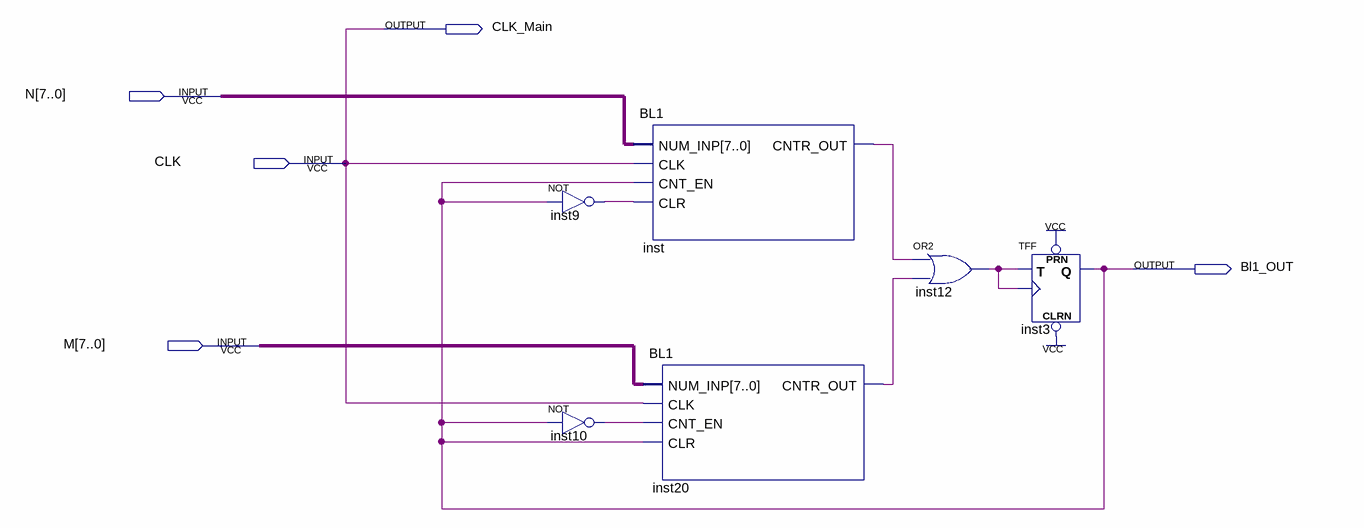
[diagram p0: schematic sheet]
// Quartus schematic BLOCK_1.bdf as structural Verilog: 6 symbols, 5 pins
module BLOCK_1 (
  input  [7:0] N,
  input  CLK,
  input  [7:0] M,
  output CLK_Main,
  output Bl1_OUT
);

  wire inst9_out, inst10_out, inst12_out, inst20_cntr_out, inst_cntr_out;

  not inst9 (inst9_out, Bl1_OUT);
  not inst10 (inst10_out, Bl1_OUT);
  BL1 inst (.NUM_INP(N), .CLK(CLK), .CNT_EN(Bl1_OUT), .CLR(inst9_out), .CNTR_OUT(inst_cntr_out));
  BL1 inst20 (.NUM_INP(M), .CLK(CLK), .CNT_EN(inst10_out), .CLR(Bl1_OUT), .CNTR_OUT(inst20_cntr_out));
  or inst12 (inst12_out, inst_cntr_out, inst20_cntr_out);
  TFF inst3 (.PRN(1'b1), .CLRN(1'b1), .T(inst12_out), .CLK(inst12_out), .Q(Bl1_OUT));

  assign CLK_Main = CLK;
endmodule
